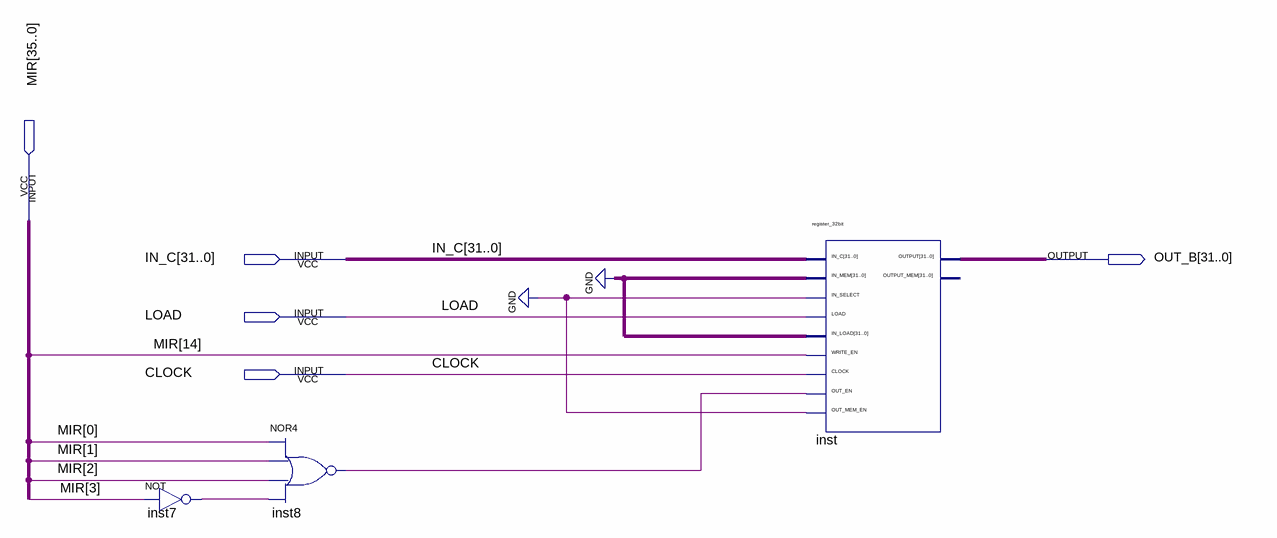
[diagram p0: schematic sheet]
// Quartus schematic OPC.bdf as structural Verilog: 3 symbols, 5 pins
module OPC (
  input  [35:0] MIR,
  input  [31:0] IN_C,
  input  LOAD,
  input  CLOCK,
  output [31:0] OUT_B
);

  wire inst7_out, inst8_out;

  not inst7 (inst7_out, MIR[3]);
  nor inst8 (inst8_out, MIR[0], MIR[1], MIR[2], inst7_out);
  register_32bit inst (
    .IN_LOAD({32{1'b0}}), .IN_C(IN_C), .LOAD(LOAD), .IN_MEM({32{1'b0}}), .IN_SELECT(1'b0),
    .WRITE_EN(MIR[14]), .CLOCK(CLOCK), .OUT_EN(inst8_out), .OUT_MEM_EN(1'b0), .OUTPUT(OUT_B));  // open: OUTPUT_MEM
endmodule
